# EAGLE design sensore-linea (EAGLE 9.2.2)
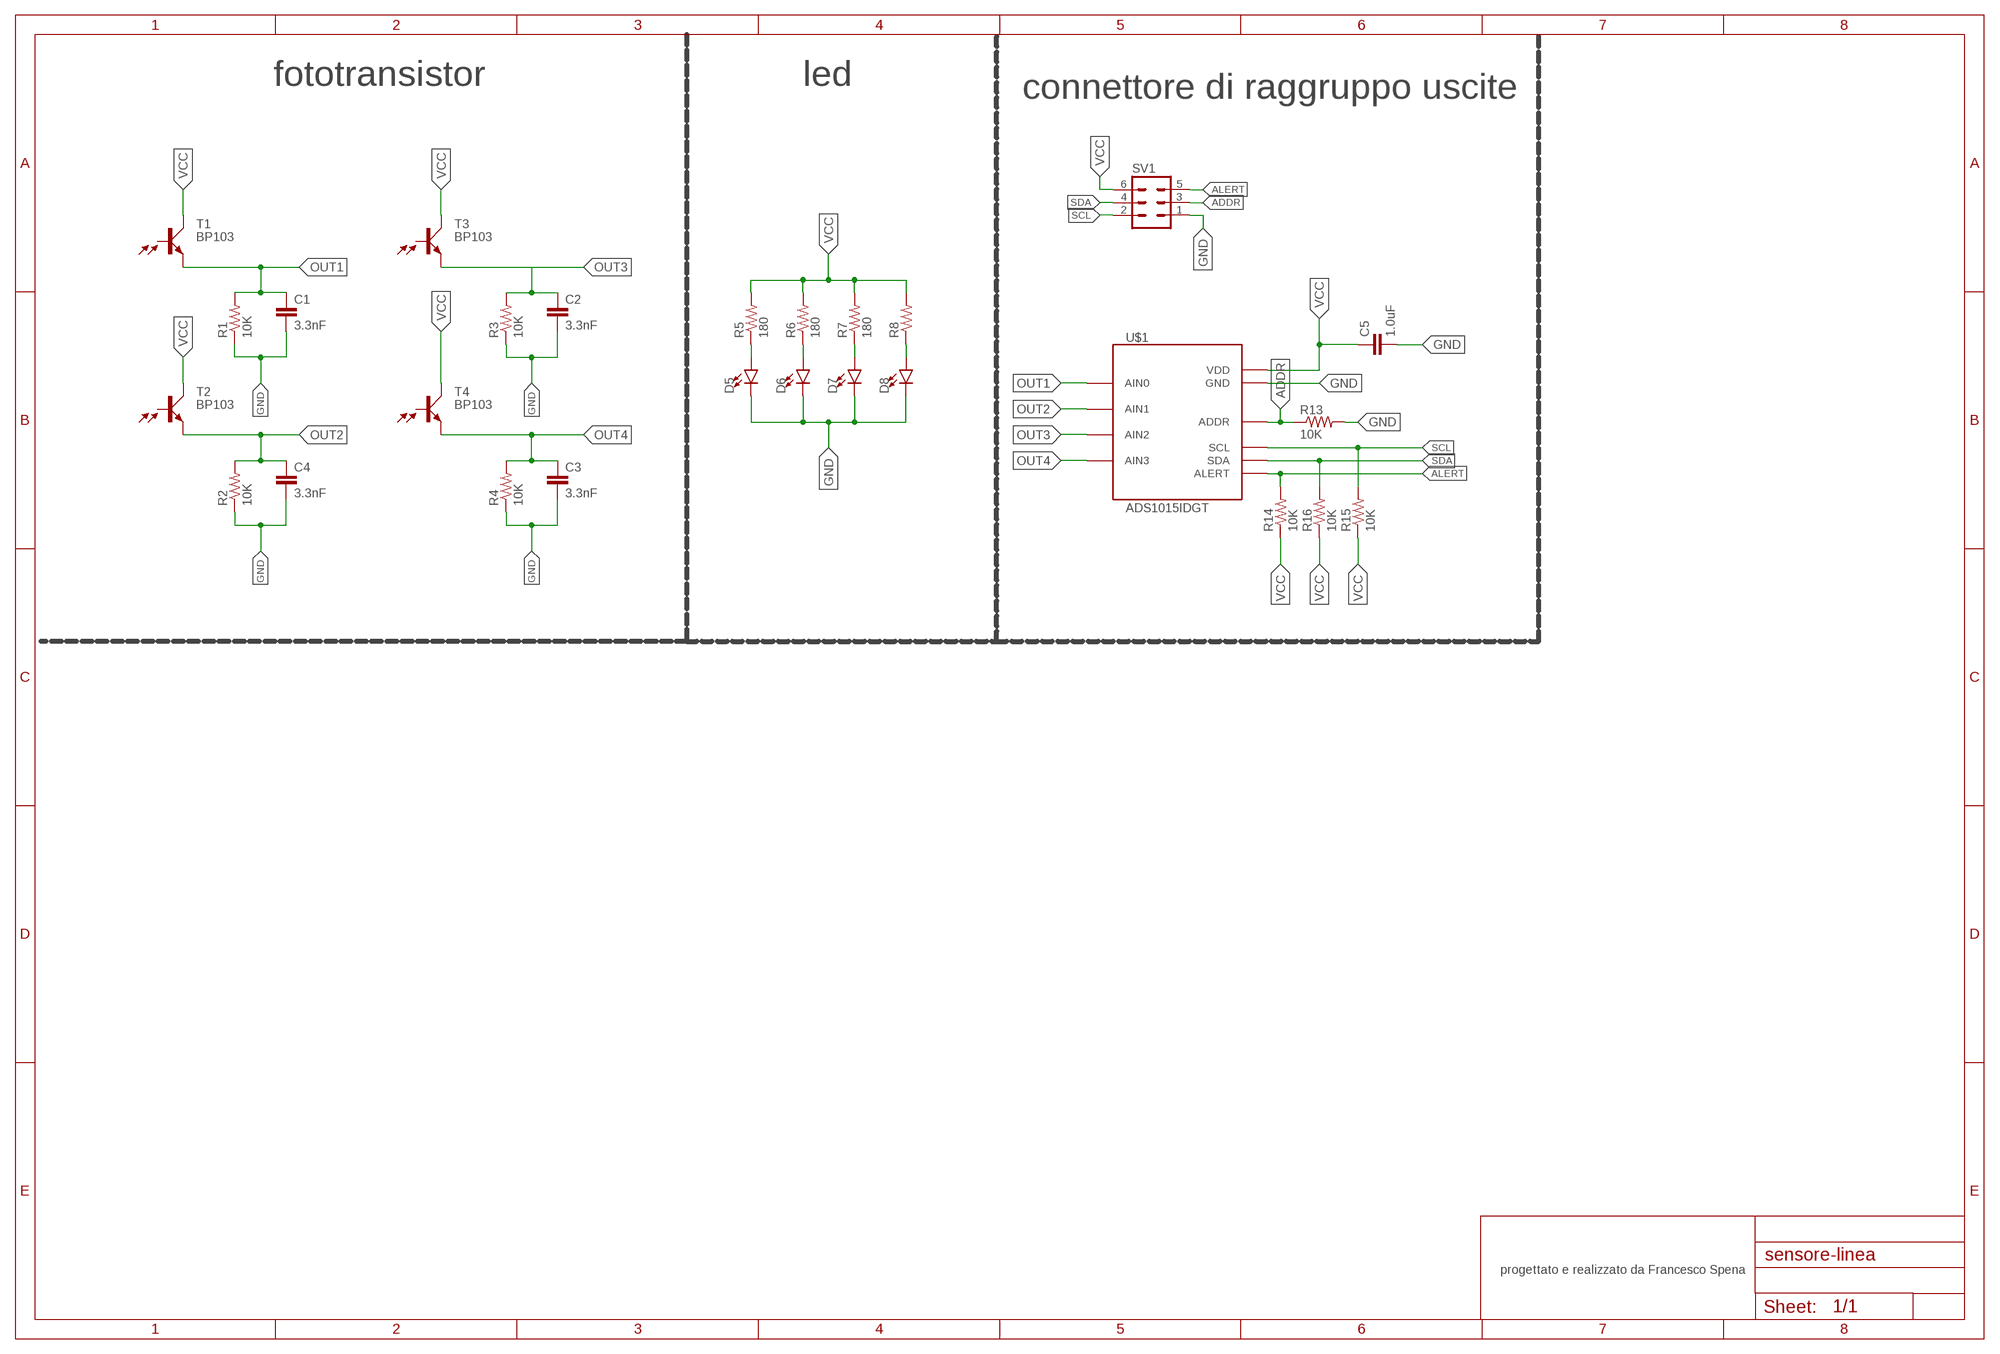
[diagram p0: schematic, sheet 1]

## Parts
C1  3.3nF  3.3NF-0603-100V-10%  [0603]
C2  3.3nF  3.3NF-0603-100V-10%  [0603]
C3  3.3nF  3.3NF-0603-100V-10%  [0603]
C4  3.3nF  3.3NF-0603-100V-10%  [0603]
C5  1.0uF  1.0UF-0402-16V-10%  [0402]
D5  LED3MM  [LED_3MM]
D6  LED3MM  [LED_3MM]
D7  LED3MM  [LED_3MM]
D8  LED3MM  [LED_3MM]
R1  10K  R-US_0204/7  [0204/7]
R2  10K  R-US_0204/7  [0204/7]
R3  10K  R-US_0204/7  [0204/7]
R4  10K  R-US_0204/7  [0204/7]
R5  180  R-US_0204/7  [0204/7]
R6  180  R-US_0204/7  [0204/7]
R7  180  R-US_0204/7  [0204/7]
R8  R-US_0204/7  [0204/7]
R13  10K  R-US_0204/7  [0204/7]
R14  10K  R-US_0204/7  [0204/7]
R15  10K  R-US_0204/7  [0204/7]
R16  10K  R-US_0204/7  [0204/7]
SV1  MA03-2  [MA03-2]
T1  BP103  [BP103]
T2  BP103  [BP103]
T3  BP103  [BP103]
T4  BP103  [BP103]
U$1  ADS1015IDGT  [MSOP10_0.5]

## Nets
ADDR: R13.1 SV1.3 U$1.1(ADDR)
ALERT: R14.2 SV1.5 U$1.2(ALERT)
GND: C1.2 C2.2 C3.2 C4.2 C5.2 D5.K(C) D6.K(C) D7.K(C) D8.K(C) R1.1 R2.1 R3.1 R4.1 R13.2 SV1.1 U$1.3(GND)
N$2: D5.A R5.1
N$3: D6.A R6.1
N$4: D7.A R7.1
N$5: D8.A R8.1
OUT1: C1.1 R1.2 T1.E U$1.4(AIN0)
OUT2: C4.1 R2.2 T2.E U$1.5(AIN1)
OUT3: C2.1 R3.2 T3.E U$1.6(AIN2)
OUT4: C3.1 R4.2 T4.E U$1.7(AIN3)
SCL: R15.2 SV1.2 U$1.10(SCL)
SDA: R16.2 SV1.4 U$1.9(SDA)
VCC: C5.1 R5.2 R6.2 R7.2 R8.2 R14.1 R15.1 R16.1 SV1.6 T1.C T2.C T3.C T4.C U$1.8(VDD)
Unconnected: T1.B T2.B T3.B T4.B

## Notes on the sheet
- fototransistor | led
- connettore di raggruppo uscite
- progettato e realizzato da Francesco Spena

## Library data of the parts
C1-C4 = SparkFun-Capacitors:3.3NF: 3.3nF ceramic capacitors A capacitor is a passive two-terminal electrical component used to store electrical energy temporarily in an electric field.; PROD_ID: CAP-09633
C5 = SparkFun-Capacitors:1.0UF: 1µF ceramic capacitors A capacitor is a passive two-terminal electrical component used to store electrical energy temporarily in an electric field.; PROD_ID: CAP-12417
D5-D8 = SparkFun-LED:LED: LED (Generic) Standard schematic elements and footprints for 5mm, 3mm, 1206, and 0603 sized LEDs. Generic LEDs with no color specified.; PROD_ID: DIO-08794
R1-R4 R13-R16 = resistor:R-US_: RESISTOR, American symbol
R5-R8 = rcl:R-US_: RESISTOR, American symbol; SPICEPREFIX: R
SV1 = con-lstb:MA03-2: PIN HEADER; OC_FARNELL: unknown; OC_NEWARK: unknown
T1-T4 = opto-trans-siemens:BP103: PHOTO TRANSISTOR; OC_FARNELL: unknown; OC_NEWARK: unknown
U$1 = bt_adc:ADS1015: Ti ADS1015 12-bit ADC Ultra-Small, Low-Power, 12-Bit Analog-to-Digital Converter with Internal Reference The ADS1013, ADS1014, and ADS1015 are precision analog-to-digital converters (ADCs) with 12 bits of resolution offered in an ultra-small, leadless QFN-10 package or an MSOP-10 package. \ Source: http://focus.ti.com/docs/prod/folders/print/ads1015.html

## Board
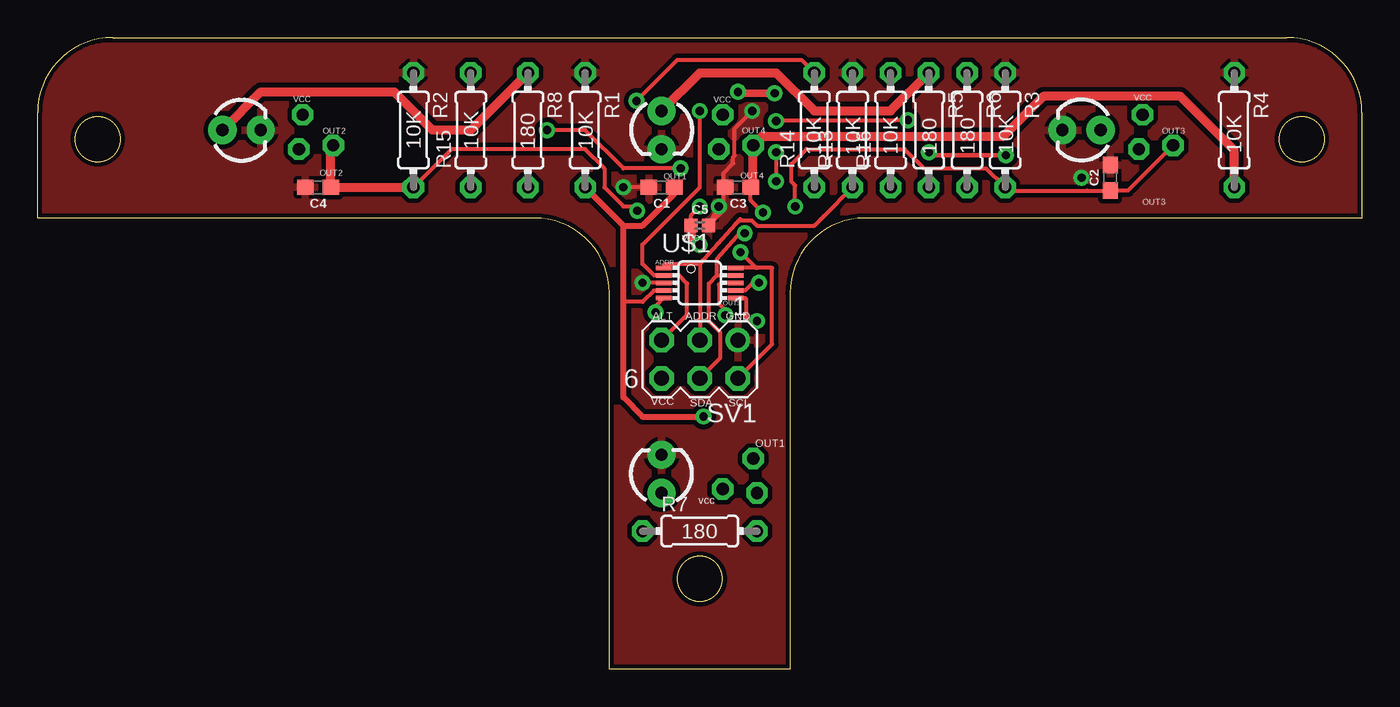
[diagram p1: board, top side]
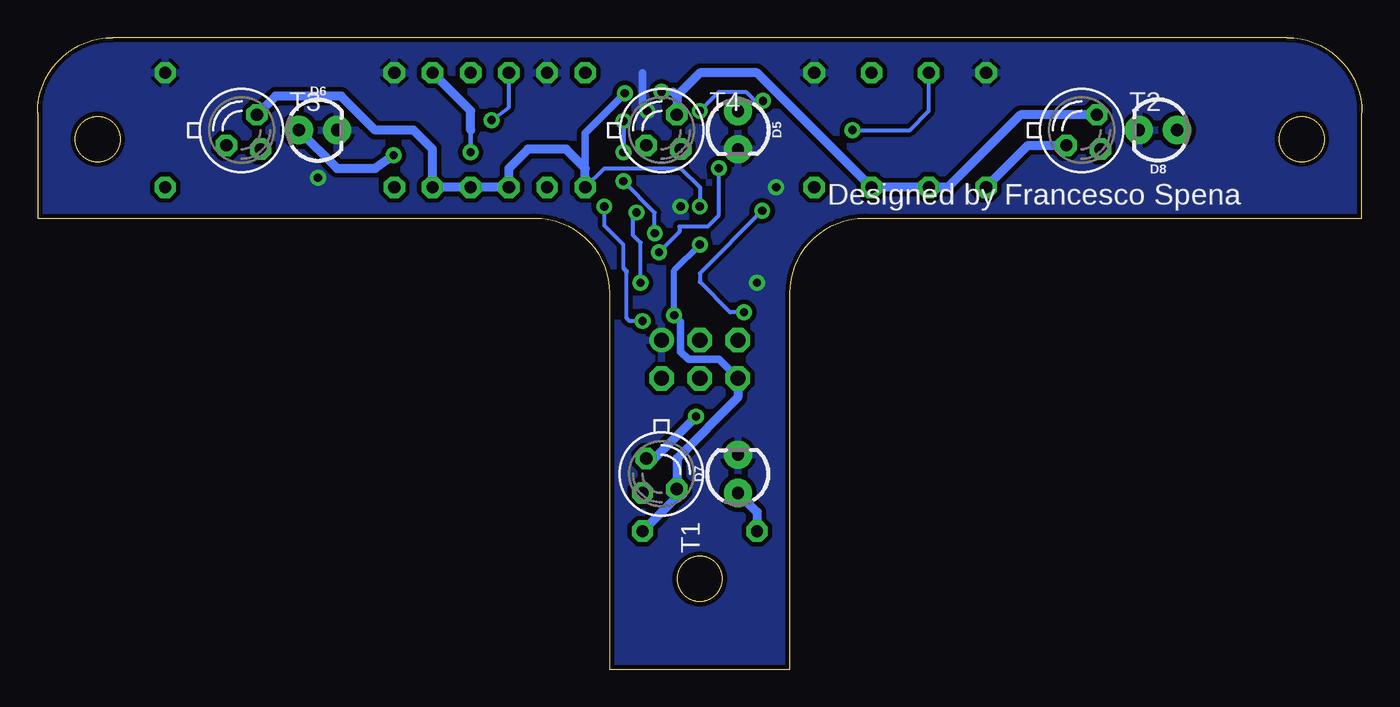
[diagram p2: board, bottom side, seen from below]

Size 88.1 x 42 mm. Coordinates in mm from the lower left corner, seen from the top.
Outline: 50.05,0 38.05,0 38.05,25 arc90 33.05,30 0,30 0,37 arc-90 5,42 83.1,42 arc-90 88.1,37 88.1,30 55.05,30 arc90 50.05,25 50.05,0
Outline: circle at 4,35.25 radius 1.5
Outline: circle at 84.1,35.25 radius 1.5
Outline: circle at 44.05,6 radius 1.5
Copper layers (1*16): Top 0.035mm / dielectric 1.5mm / Bottom 0.035mm
Design rules "SparkFun": minimum track width 8mil, minimum drill 20mil, track to track 8mil, track to pad 8mil, pad to pad 8mil, via to via 8mil, smd to smd 8mil, copper to edge 8mil, drill to drill 8mil, minimum pad ring 12mil, minimum via ring 10mil, stop-mask expansion 4mil, vias tented up to drill 20mil, thermal gap 10mil

### Footprints (pad centres in the part's own frame; a part is rotated, then mirrored left to right if it is on the bottom)
0603 = smd 1.1 x 1: 1 -0.85,0; 2 0.85,0
0402 = smd 0.85 x 0.9: 1 -0.58,0; 2 0.58,0
LED_3MM = drill 0.813 pad 1.88: A -1.27,0; K 1.27,0
0204/7 = drill 0.813 octagon: 1 -3.81,0; 2 3.81,0
MA03-2 = drill 1.016: 1 -2.54,-1.27 | drill 1.016 octagon: 2 -2.54,1.27; 3 0,-1.27; 4 0,1.27; 5 2.54,-1.27; 6 2.54,1.27
BP103 = drill 0.813 octagon: B 1.27,-1.27; C 1.016,1.016; E -1.016,-1.016
MSOP10_0.5 = smd 0.3 x 1.02: 1 -1,-2.4; 2 -0.5,-2.4; 3 0,-2.4; 4 0.5,-2.4; 5 1,-2.4; 6 1,2.4; 7 0.5,2.4; 8 0,2.4; 9 -0.5,2.4; 10 -1,2.4

### Placement (x,y rotation side)
C1  41.51,32.04 180 top
C2  71.36,32.67 90 top
C3  46.59,32.04 180 top
C4  18.65,32.04 180 top
C5  44.05,29.5 0 top
D5  41.51,35.85 270 bottom
D6  69.45,35.85 0 bottom
D7  41.51,12.99 90 bottom
D8  13.57,35.85 180 bottom
R1  36.43,35.85 270 top
R2  25,35.85 270 top
R3  64.37,35.85 270 top
R4  79.61,35.85 270 top
R5  59.29,35.85 270 top
R6  61.83,35.85 270 top
R7  44.05,9.18 0 top
R8  32.62,35.85 270 top
R13  54.21,35.85 90 top
R14  51.67,35.85 90 top
R15  28.81,35.85 90 top
R16  56.75,35.85 90 top
SV1  44.05,20.61 180 top
T1  46.59,12.99 270 bottom
T2  18.65,35.85 0 bottom
T3  74.53,35.85 0 bottom
T4  46.59,35.85 0 bottom
U$1  44.05,25.69 270 top

### Tracks (layer width: path | path; a pad name or v marks a point on that pad's centre or on a via)
ADDR
  Top 0.254: U$1.1 arc-90 41.92,26.96 44.05,26.96 | 44.05,26.96 SV1.3 | 44.05,26.96 45.25,28.29 46.46,29.62 | 46.46,29.62 46.67,29.86 46.74,29.93 | R13.1 52.31,30.14 52.1,29.93 51.67,29.5 47.86,29.5 47.51,29.85 46.69,29.85 46.46,29.62
ALERT  (via drill 0.55)
  Top 0.254: v44.05,37.12 44.05,32.04 40.24,28.23 40.24,26.96 41.01,26.19 U$1.2 42.66,26.19 43.21,25.64 43.21,23.58 SV1.5 | R14.2 50.81,40.52 42.57,40.52 v39.84,37.79
  Bottom 0.254: v39.84,37.79 40.39,37.79 40.99,38.39 42.78,38.39 v44.05,37.12
GND  (via drill 0.55)
  Top 0.254: U$1.3 v40.24,25.69 | v45.32,30.77 C5.2 45.64,30.51 45.64,32.99 46.27,33.63 46.27,34.06 46.36,34.15 46.36,35.94 v47.54,37.12 | C1.2 v38.97,32.04
  Bottom 0.508: v47.54,37.12 47.86,37.44 47.86,39.66
  other vias: 69.45,32.67
  pour Top (isolate 0.305): 91.04,46.01 -1.67,46.01 -1.67,-2.25 91.04,-2.25
  pour Bottom (isolate 0.305): 91.04,46.01 -1.67,46.01 -1.67,-2.25 91.04,-2.25
N$2
  Top 0.61: D5.A 44.05,39.66 49.13,39.66 51.67,37.12 56.75,37.12 R5.1
N$3  (via drill 0.55)
  Top 0.254: 64.37,34.17 v64.42,34.17
  Top 0.305: 64.37,34.17 59.5,34.17 v59.29,34.38
  Bottom 0.305: v59.29,34.38 59.29,35.85
  Bottom 0.61: D6.A 68.18,33.31 65.64,33.31 v64.42,34.17 | 59.29,35.85 59.29,37.12 R6.1
N$4
  Bottom 0.61: D7.A 40.24,10.45 R7.1
N$5
  Top 0.61: D8.A 14.84,38.39 23.73,38.39 26.27,35.85 28.81,35.85 R8.1
OUT1  (via drill 0.55)
  Top 0.254: U$1.4 41.63,25.17 41,25.17 40.25,24.42 38.97,24.42 | 44.05,16.8 v44.31,16.8
  Top 0.406: 44.05,16.8 40.24,16.8 38.97,18.07 38.97,24.42 38.97,29.5 | 38.97,29.5 R1.2 | 38.97,29.5 40.24,29.5 42.36,31.62 C1.1
  Bottom 0.61: v44.31,16.8 47.1,14.01 T1.E
OUT2  (via drill 0.55)
  Top 0.254: R2.2 27.54,34.58 36.43,34.58 37.7,33.31 37.7,32.04 38.97,30.77 39.61,30.77 v39.9,30.48 | U$1.5 41.11,24.14 v41.11,23.73
  Top 0.61: T2.E 19.5,34.67 C4.1 R2.2
  Bottom 0.254: v41.11,23.73 42.03,23.73 44.05,25.75 44.05,26.33 v39.9,30.48
  Bottom 0.61: T2.E 22.21,34.83 R2.2
OUT3  (via drill 0.55)
  Top 0.254: U$1.6 47.07,24.69 47.14,24.62 47.14,23.35 47.35,23.15 v47.86,23.15 | 71.14,32.04 C2.1 | T3.E 72.54,31.83 C2.1 | C2.1 69.82,31.83 69.81,31.82 64.6,31.82 R3.2 63.1,33.31 58.95,33.31 57.68,34.58 51.14,34.58 50.15,33.59 50.15,32.42 50.4,32.17 v50.4,30.77
  Bottom 0.254: 49.13,26.7 48.91,26.47 | 49.13,26.7 49.09,26.6 48.91,26.41 48.91,23.35 48.71,23.15 v47.86,23.15 | 49.13,26.7 49.13,28.23 50.4,29.5 v50.4,30.77
OUT4  (via drill 0.55)
  Top 0.254: U$1.7 46.47,25.21 47.1,25.21 47.58,25.69 v47.99,25.69 | v48.26,30.37 47.44,31.19 C3.1
  Top 0.61: C3.1 47.61,32.21 T4.E 48.19,35.42 64.23,35.42 66.91,38.1 76.03,38.1 79.61,34.52 R4.2
  Bottom 0.254: v47.99,25.69 47.99,28.36 48.5,28.87 48.5,30.14 v48.26,30.37
SCL  (via drill 0.55)
  Top 0.254: SV1.2 48.86,21.61 48.86,26.69 47.86,26.69 47.8,26.69 | 47.8,26.69 U$1.10 | v42.78,33.31 38.97,33.31 36.43,35.85 v33.89,35.85 | v46.76,27.73 47.8,26.69
  Bottom 0.254: v33.89,35.85 30.08,35.85 28.81,37.12 R15.2 | v42.78,33.31 42.78,30.19 43.54,29.42 45.4,29.42 45.4,29.09 v46.76,27.73
SDA  (via drill 0.55)
  Top 0.254: SV1.4 45.42,20.71 45.42,22.39 44.66,23.15 44.66,25.64 45.21,26.19 | 45.21,26.19 U$1.9 | 45.21,26.19 45.21,27.28 46.81,29.08 46.96,29.08 v47.05,28.99 | v57.89,36.51 57.04,36.51 57.01,36.48 49.13,36.48 v49.13,36.45 | v49.13,34.38 v49.13,32.45
  Bottom 0.254: v57.89,36.51 56.75,37.38 R16.2 | v49.13,36.45 v49.13,34.38 | v47.05,28.99 47.05,30.37 v49.13,32.45
VCC  (via drill 0.55)
  Top 0.254: C5.1 43.47,30.19 v44.05,30.77 | U$1.8 45.46,25.69 45.33,25.56 45.33,24.28 45.75,23.86 v45.75,23.53
  Top 0.406: 43.47,28.7 43.94,28.23 v44.05,28.23
  Top 0.508: v46.59,38.39 46.69,38.29 v49.03,38.29
  Top 0.61: C5.1 43.47,28.7
  Bottom 0.254: R14.1 50.4,33.31 45.32,33.31 44.05,32.04 v44.05,30.77
  Bottom 0.406: v45.75,23.53 45.75,26.53 v44.05,28.23
  Bottom 0.508: SV1.6 42.78,20.61 44.81,20.61 45.32,21.12 45.32,23.1 v45.75,23.53 | 45.83,38.39 v46.59,38.39 | 51.67,33.31 51.67,35.65 v49.03,38.29
  Bottom 0.61: R14.1 51.67,33.31 52.94,34.58 55.48,34.58 56.75,33.31 R16.1 R5.2 R6.2 61.83,34.58 63.1,35.85 65.64,35.85 67.9,38.11 72.27,38.11 T3.C | SV1.6 41.51,18.07 45.58,14.01 T1.C 45.58,11.47 R7.2 | T2.C 22.72,36.87 27.54,32.04 R15.1 R8.2 40.24,39.66 44.05,39.66 45.58,38.14 | 45.58,38.14 T4.C | 45.83,38.39 45.58,38.14

### Text on the board
tPlace: VCC | VCC | VCC | OUT2 | OUT4 | OUT3 | 10K | 10K | 180 | 10K | 10K | 10K | 10K | 180 | 180 | 10K | 10K | OUT2 | OUT1 | OUT4 | OUT3 | VCC | ADDR | OUT3 | ALT | ADDR | GND | VCC | SDA | SCL | OUT1 | vcc | 180
bPlace: Designed by Francesco Spena